# EAGLE schematic 00A-052 (EAGLE 6.3)
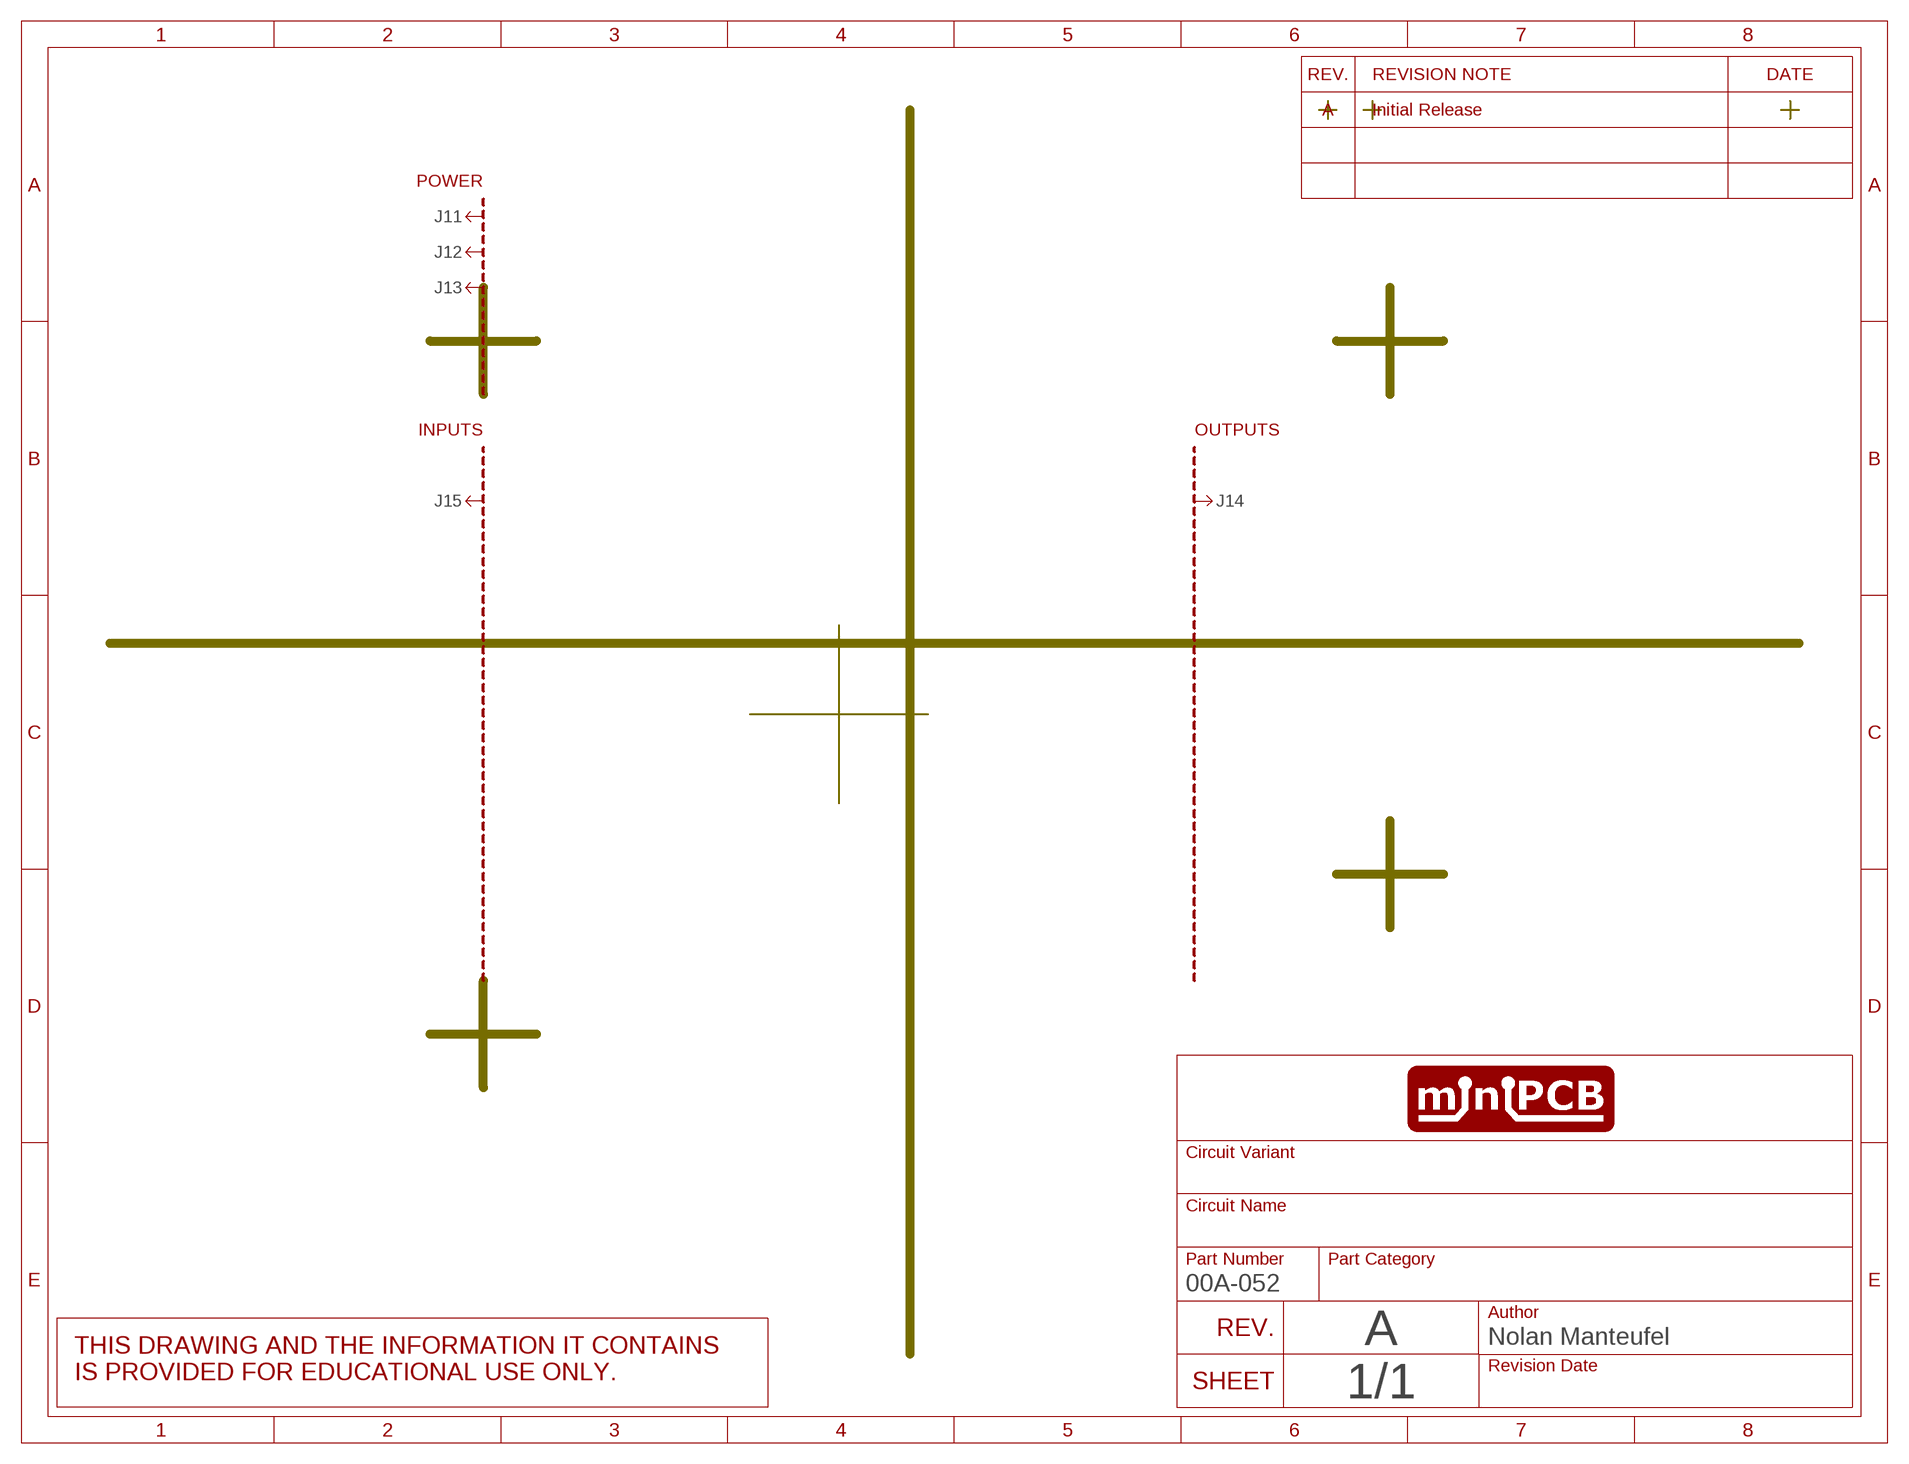
[diagram p0: schematic, sheet 1]
SHEET1 (SCHEMATIC): REVISION: A

## Parts
J1  MINIPCB_5P20X15  [MINIPCB_5P_20X15MM]
Unconnected: J1.1 J1.2 J1.3 J1.4 J1.5

## Library data of the parts
J1 = minipcb:MINIPCB_5P; REVISION: A